# Altium schematic sheet map 5v to 3v3.SchDoc
size A
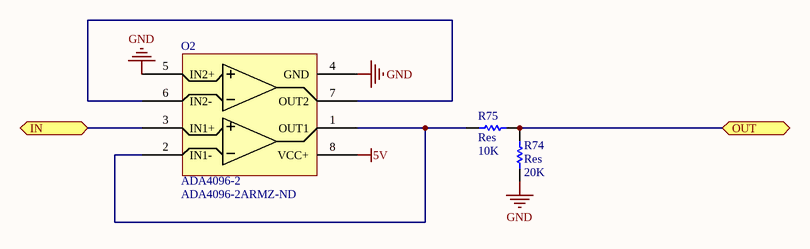
[diagram p0: map 5v to 3v3.SchDoc]

## Parts
O2  ADA4096-2  Supplier Part Number 1: ADA4096-2ARMZ-ND  [TSSOP8]
R74  Res  value 20K  [2012[0805]]
R75  Res  value 10K  [2012[0805]]

## Ports
IN, OUT

## Nets
5V: O2.8(VCC+)
GND: O2.4(GND) O2.5(IN2+) R74.2
IN: O2.3(IN1+) ; port IN
OUT: R74.1 R75.1 ; port OUT
NetO2_1: O2.1(OUT1) O2.2(IN1-) R75.2
NetO2_6: O2.6(IN2-) O2.7(OUT2)

## Library data of the parts
O2 = ADA4096-2: 2 Op-Amps, 8-TSSOP, 32V Overvoltage Protection; Supplier 1: Digi-Key
R74 R75 = Res: Surface Mount Resistor; Published: 8-Jun-2000; LatestRevisionDate: 17-Jul-2002; LatestRevisionNote: Re-released for DXP Platform.; PackageReference: AXIAL-0.5; Publisher: Altium Limited